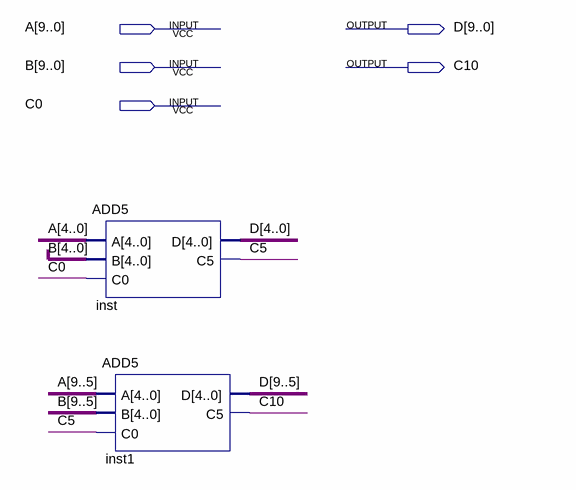
[diagram p0: schematic sheet]
// Quartus schematic ADD10.bdf as structural Verilog: 2 symbols, 5 pins
module ADD10 (
  input  [9:0] A,
  input  [9:0] B,
  input  C0,
  output [9:0] D,
  output C10
);

  wire C5;

  ADD5 inst (.A(A[4:0]), .B(B[4:0]), .C0(C0), .D(D[4:0]), .C5(C5));
  ADD5 inst1 (.A(A[9:5]), .B(B[9:5]), .C0(C5), .D(D[9:5]), .C5(C10));
endmodule
